# EAGLE design IonSensorRevC (EAGLE 9.6.2)
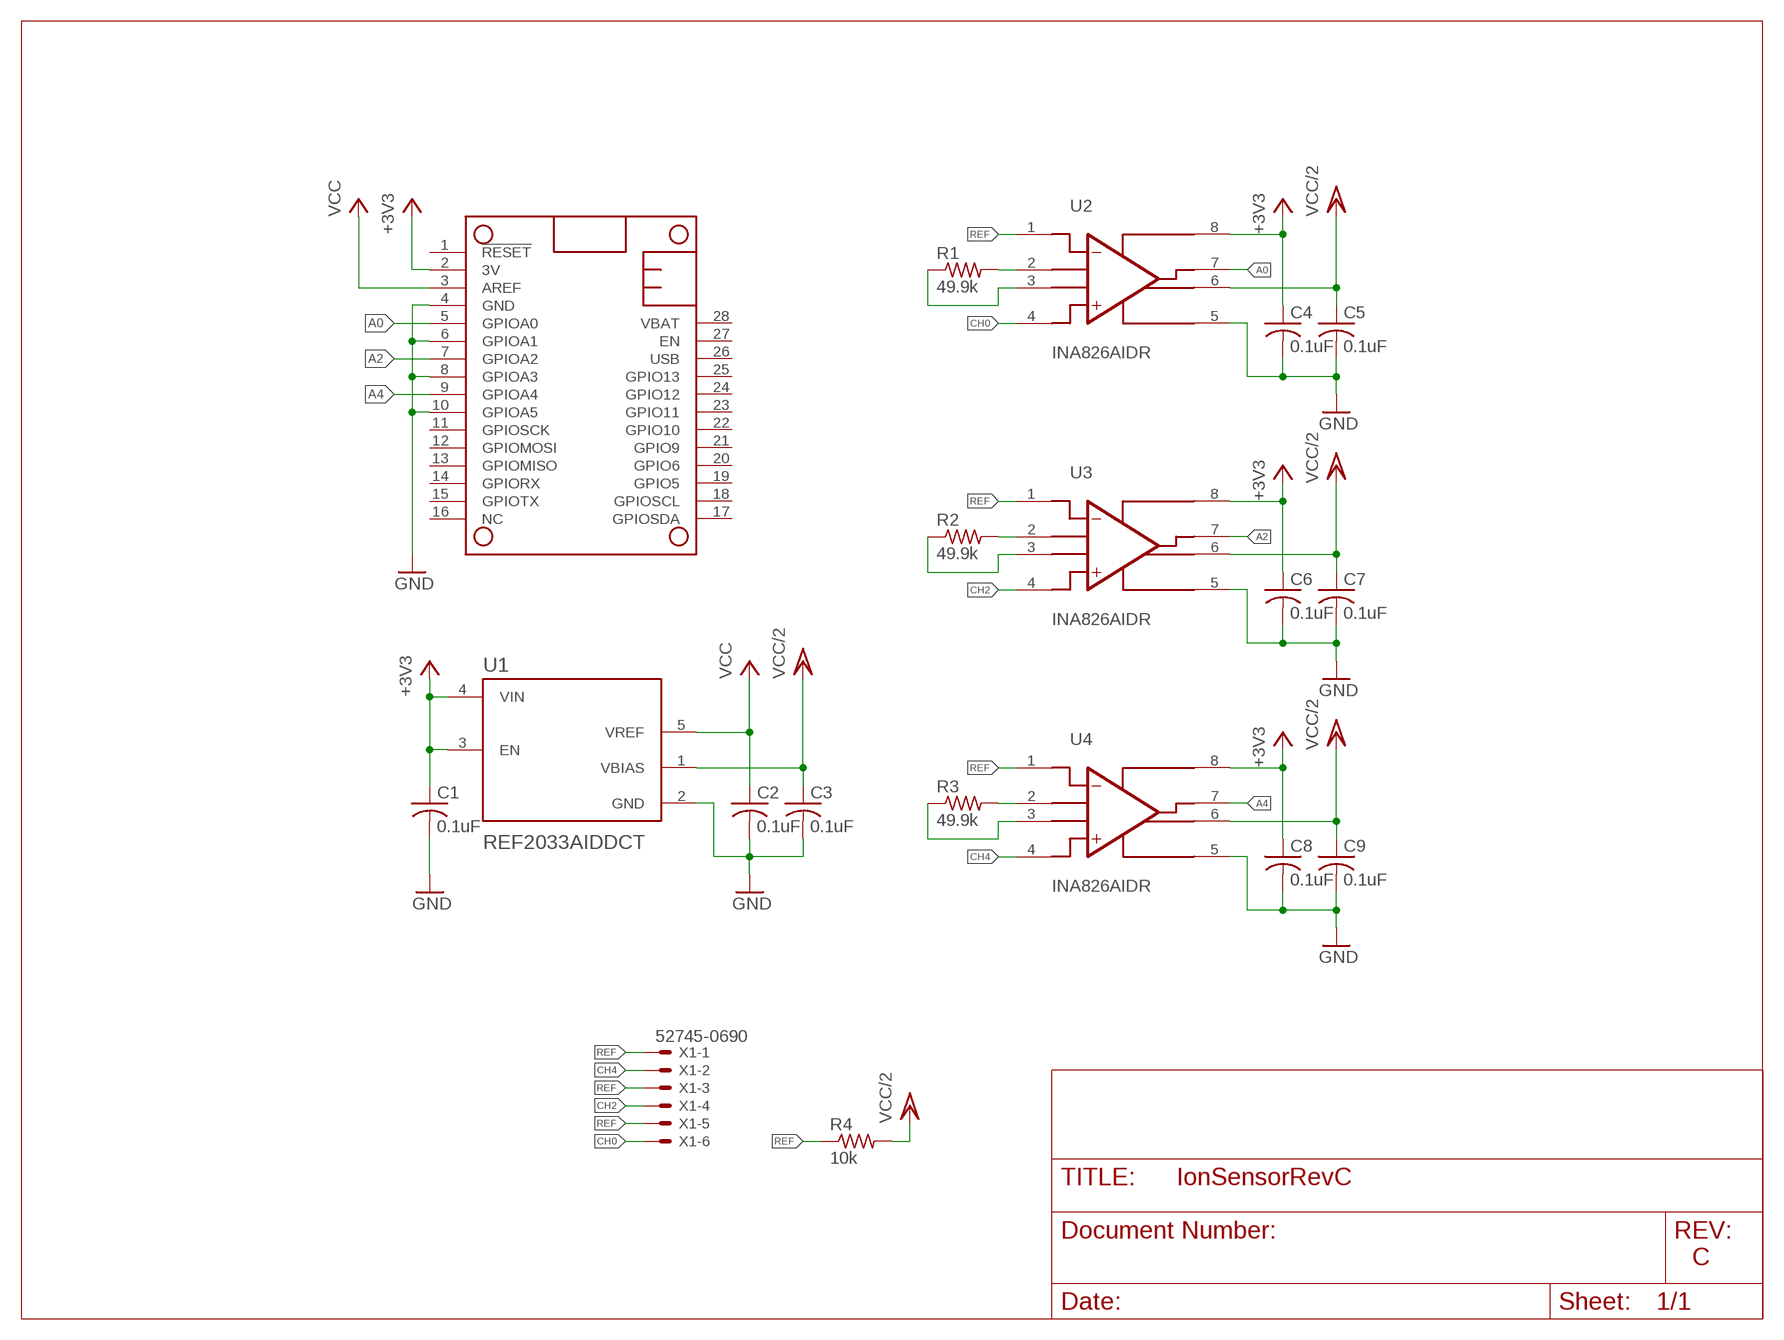
[diagram p0: schematic, sheet 1]

## Parts
C1  0.1uF  C-USC0402  [C0402]
C2  0.1uF  C-USC0402  [C0402]
C3  0.1uF  C-USC0402  [C0402]
C4  0.1uF  C-USC0402  [C0402]
C5  0.1uF  C-USC0402  [C0402]
C6  0.1uF  C-USC0402  [C0402]
C7  0.1uF  C-USC0402  [C0402]
C8  0.1uF  C-USC0402  [C0402]
C9  0.1uF  C-USC0402  [C0402]
MS1  FEATHERWING  [FEATHERWING]
R1  49.9k  R-US_R0402  [R0402]
R2  49.9k  R-US_R0402  [R0402]
R3  49.9k  R-US_R0402  [R0402]
R4  10k  R-US_R0402  [R0402]
U1  REF2033AIDDCT  [SOT95P280X110-5N]
U2  INA826AIDR  [SOIC127P599X175-8N]
U3  INA826AIDR  [SOIC127P599X175-8N]
U4  INA826AIDR  [SOIC127P599X175-8N]
X1  52745-0690  [52745-0690]

## Nets
+3V3: C1.1 C4.1 C6.1 C8.1 MS1.2(3V) U1.3(EN) U1.4(VIN) U2.8(+VS) U3.8(+VS) U4.8(+VS)
A0: MS1.5(GPIOA0) U2.7(VOUT)
A2: MS1.7(GPIOA2) U3.7(VOUT)
A4: MS1.9(GPIOA4) U4.7(VOUT)
CH0: U2.4(+IN) X1.6
CH2: U3.4(+IN) X1.4
CH4: U4.4(+IN) X1.2
GND: C1.2 C2.2 C3.2 C4.2 C5.2 C6.2 C7.2 C8.2 C9.2 MS1.4(GND) MS1.6(GPIOA1) MS1.8(GPIOA3) MS1.10(GPIOA5) U1.2(GND) U2.5(-VS) U3.5(-VS) U4.5(-VS)
N$1: R1.2 U2.2(RG_2)
N$2: R1.1 U2.3(RG_3)
N$3: R2.2 U3.2(RG_2)
N$4: R2.1 U3.3(RG_3)
N$5: R3.2 U4.2(RG_2)
N$6: R3.1 U4.3(RG_3)
REF: R4.1 U2.1(-IN) U3.1(-IN) U4.1(-IN) X1.1 X1.3 X1.5
VCC: C2.1 MS1.3(AREF) U1.5(VREF)
VCC/2: C3.1 C5.1 C7.1 C9.1 R4.2 U1.1(VBIAS) U2.6(REF) U3.6(REF) U4.6(REF)
Unconnected: MS1.1(!RESET) MS1.11(GPIOSCK) MS1.12(GPIOMOSI) MS1.13(GPIOMISO) MS1.14(GPIORX) MS1.15(GPIOTX) MS1.16(NC) MS1.17(GPIOSDA) MS1.18(GPIOSCL) MS1.19(GPIO5) MS1.20(GPIO6) MS1.21(GPIO9) MS1.22(GPIO10) MS1.23(GPIO11) MS1.24(GPIO12) MS1.25(GPIO13) MS1.26(USB) MS1.27(EN) MS1.28(VBAT)

## Notes on the sheet
- C

## Library data of the parts
C1-C9 = adafruit:C-US: CAPACITOR, American symbol
MS1 = adafruit:FEATHERWING
R1-R4 = adafruit:R-US_: RESISTOR, American symbol
U1 = REF2033AIDDCT:REF2033AIDDCT: 3.3-V Vref, low-drift, low-power, dual-output Vref & Vref/2 voltage reference 5-SOT-23-THIN -40 to 125 Check availability <https://pricing.snapeda.com/parts/REF2033AIDDCT/Texas%20Instruments/view-part?ref=eda>; AVAILABILITY: In Stock; DESCRIPTION: 3.3-V Vref, low-drift, low-power, dual-output Vref & Vref/2 voltage reference; MF: Texas Instruments; MP: REF2033AIDDCT; PACKAGE: SOT-23-THN-5 Texas Instruments; PRICE: None; PURCHASE-URL: https://pricing.snapeda.com/search/part/REF2033AIDDCT/?ref=eda
U2-U4 = INA826AIDR:INA826AIDR: Precision, 200-?A Supply Current, 36-V Supply Instrumentation Amplifier 8-SOIC -40 to 125 Check availability <https://pricing.snapeda.com/parts/INA826AIDR/Texas%20Instruments/view-part?ref=eda>; AVAILABILITY: In Stock; DESCRIPTION: Precision, 200-μA Supply Current, 36-V Supply Instrumentation Amplifier; MF: Texas Instruments; MP: INA826AIDR; PACKAGE: SOIC-8 Texas Instruments; PRICE: None; PURCHASE-URL: https://pricing.snapeda.com/search/part/INA826AIDR/?ref=eda
X1 = con-molex:52745-0690: FFC/FPC-to-Board 0.50mm (.020") SMT Top Contact Right Angle, ZIF, Style Receptacle 52745 / 52435 Source: http://www.molex.com/product/ffc/52745.html; MF: MOLEX; MPN: 52745-0690; OC_FARNELL: unknown; OC_NEWARK: 92M6374

## Board
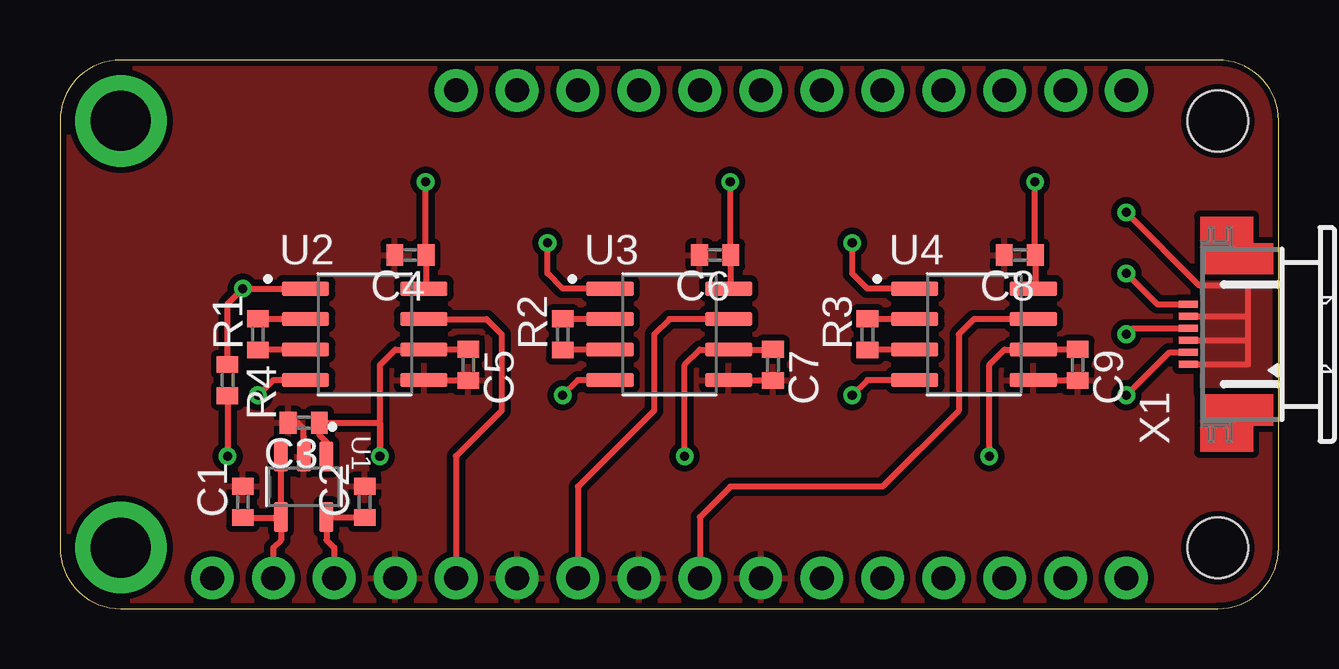
[diagram p1: board, top side]
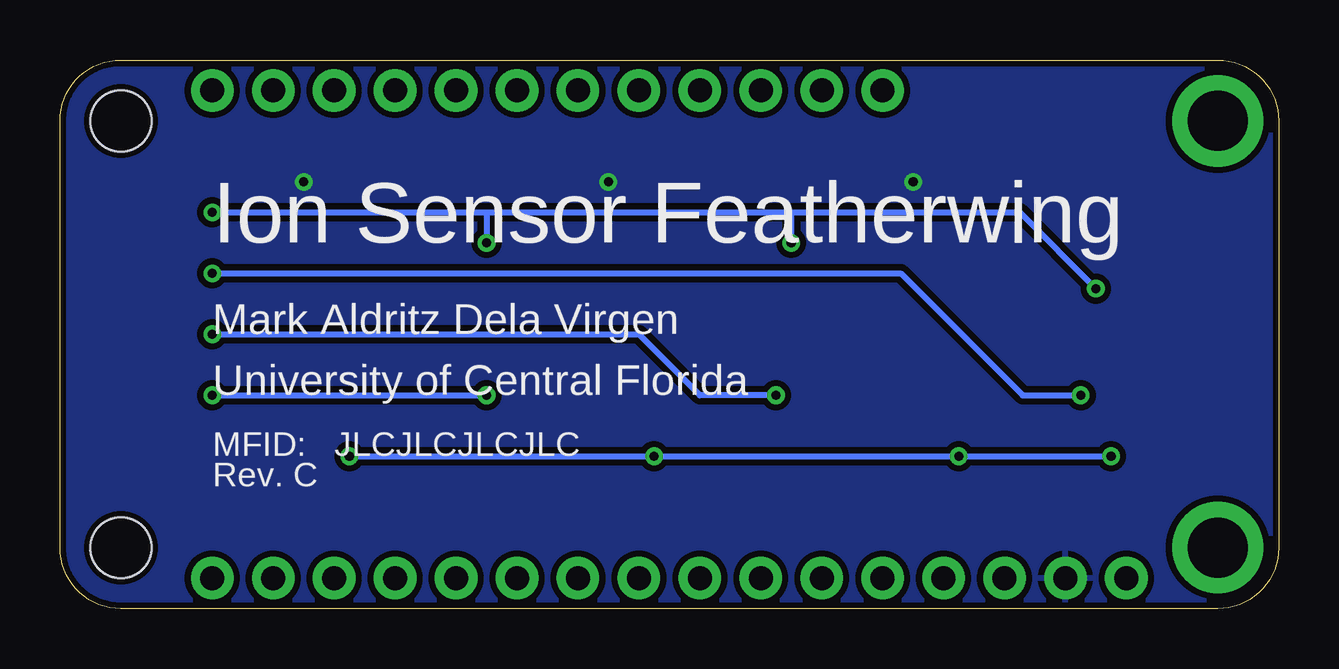
[diagram p2: board, bottom side, seen from below]

Size 50.8 x 22.86 mm. Coordinates in mm from the lower left corner, seen from the top.
Copper layers (1*16): Top 0.035mm / dielectric 1.5mm / Bottom 0.035mm
Design rules "SparkFun-2-Layer-General-JLCPCB": minimum track width 7mil, minimum drill 0.3mm, track to track 7mil, track to pad 7mil, pad to pad 7mil, via to via 7mil, smd to smd 7mil, copper to edge 7mil, drill to drill 7mil, minimum pad ring 7mil, minimum via ring 7mil, stop-mask expansion 3mil, vias tented up to drill 25mil, thermal gap 10mil

### Footprints (pad centres in the part's own frame; a part is rotated, then mirrored left to right if it is on the bottom)
C0402 = smd 0.7 x 0.9: 1 -0.65,0; 2 0.65,0
FEATHERWING = drill 1 pad 1.778: 1 6.35,1.27; 2 8.89,1.27; 3 11.43,1.27; 4 13.97,1.27; 5 16.51,1.27; 6 19.05,1.27; 7 21.59,1.27; 8 24.13,1.27; 9 26.67,1.27; 10 29.21,1.27; 11 31.75,1.27; 12 34.29,1.27; 13 36.83,1.27; 14 39.37,1.27; 15 41.91,1.27; 16 44.45,1.27; 17 44.45,21.59; 18 41.91,21.59; 19 39.37,21.59; 20 36.83,21.59; 21 34.29,21.59; 22 31.75,21.59; 23 29.21,21.59; 24 26.67,21.59; 25 24.13,21.59; 26 21.59,21.59; 27 19.05,21.59; 28 16.51,21.59 | drill 2.5 pad 3.81: P$1 2.54,20.32; P$2 2.54,2.54 | hole 2.54: 48.26,20.32; 48.26,2.54
R0402 = smd 0.7 x 0.9: 1 -0.65,0; 2 0.65,0
SOT95P280X110-5N = smd 1.25 x 0.59: 1 -1.255,0.95; 2 -1.255,0; 3 -1.255,-0.95; 4 1.255,-0.95; 5 1.255,0.95
SOIC127P599X175-8N = smd 1.97 x 0.6: 1 -2.47,1.905; 2 -2.47,0.635; 3 -2.47,-0.635; 4 -2.47,-1.905; 5 2.47,-1.905; 6 2.47,-0.635; 7 2.47,0.635; 8 2.47,1.905
52745-0690 = smd 0.3 x 0.8: 1 -1.25,2.5; 2 -0.75,2.5; 3 -0.25,2.5; 4 0.25,2.5; 5 0.75,2.5; 6 1.25,2.5

### Placement (x,y rotation side)
C1  7.62,4.45 90 top
C2  12.7,4.45 90 top
C3  10.16,7.75 180 top
C4  14.61,14.73 180 top
C5  17.02,10.16 270 top
C6  27.3,14.73 180 top
C7  29.72,10.16 270 top
C8  40.01,14.73 180 top
C9  42.42,10.16 270 top
MS1  0,0 0 top
R1  8.26,11.43 90 top
R2  20.95,11.43 90 top
R3  33.66,11.43 90 top
R4  6.99,9.53 270 top
U1  10.16,5.08 270 top
U2  12.7,11.43 0 top
U3  25.4,11.43 0 top
U4  38.1,11.43 0 top
X1  49.53,11.43 90 top

### Tracks (layer width: path | path; a pad name or v marks a point on that pad's centre or on a via)
+3V3  (via drill 0.38)
  Top 0.254: MS1.2 8.89,2.54 9.21,2.86 U1.4 | C1.1 9.18,3.79 U1.4 | U2.8 15.26,13.42 C4.1 15.24,14.75 v15.24,17.78 | U3.8 27.95,13.42 C6.1 27.94,14.75 v27.94,17.78 | U4.8 40.66,13.42 C8.1 40.64,14.75 v40.64,17.78 | U1.4 U1.3
  pour Bottom (isolate 0.254): 50.8,0 50.8,24.13 -1.27,24.13 -1.27,0
A0
  Top 0.254: U2.7 17.78,12.06 18.41,11.43 18.41,8.26 16.51,6.35 MS1.5
A2
  Top 0.254: U3.7 25.4,12.06 24.77,11.43 24.77,8.26 21.59,5.08 MS1.7
A4
  Top 0.254: U4.7 38.1,12.06 37.47,11.43 37.47,8.26 34.29,5.08 27.94,5.08 26.67,3.81 MS1.9
CH0  (via drill 0.38)
  Top 0.254: U2.4 8.89,9.53 v8.26,8.89 | v44.45,13.97 45.74,12.68 X1.6
  Bottom 0.254: v44.45,13.97 15.75,13.97 10.67,8.89 v8.26,8.89
CH2  (via drill 0.38)
  Top 0.254: U3.4 21.59,9.53 v20.95,8.89 | v44.45,11.43 44.7,11.68 X1.4
  Bottom 0.254: v44.45,11.43 26.67,11.43 24.13,8.89 v20.95,8.89
CH4  (via drill 0.38)
  Top 0.254: U4.4 33.66,9.53 v33.02,8.89 | v44.45,8.89 46.24,10.68 X1.2
  Bottom 0.254: v44.45,8.89 v33.02,8.89
GND
  Top 0.254: U2.5 17,9.53 C5.2 | U3.5 29.7,9.53 C7.2 | U4.5 42.4,9.53 C9.2 | C3.2 9.91,7.75 10.15,7.5 10.15,7.17 10.16,7.17 U1.2
  pour Top (isolate 0.254, rank 2): 0,22.86 0,-1.27 52.07,-1.27 52.07,22.86
N$1
  Top 0.254: U2.2 8.27,12.06 R1.2
N$2
  Top 0.254: U2.3 8.27,10.79 R1.1
N$3
  Top 0.254: U3.2 20.97,12.06 R2.2
N$4
  Top 0.254: U3.3 20.97,10.79 R2.1
N$5
  Top 0.254: U4.2 33.67,12.06 R3.2
N$6
  Top 0.254: U4.3 33.67,10.79 R3.1
REF  (via drill 0.38)
  Top 0.254: v33.02,15.24 33.02,13.97 33.66,13.34 U4.1 | U3.1 20.95,13.34 20.32,13.97 v20.32,15.24 | U2.1 v7.62,13.34 6.99,12.7 R4.1 | v44.45,16.51 47.5,13.46 49.53,13.46 49.53,12.18 | X1.1 49.53,10.18 49.53,11.18 | X1.3 49.53,11.18 | X1.5 49.53,12.18 | 49.53,11.18 49.53,12.18
  Bottom 0.254: v44.45,16.51 33.02,16.51 | 33.02,16.51 v33.02,15.24 | 33.02,16.51 20.32,16.51 | v20.32,15.24 20.32,16.51 | 20.32,16.51 10.79,16.51 v7.62,13.34
  pour Top (isolate 0.254): 47.62,16.51 51.44,16.51 51.44,6.35 47.62,6.35
VCC
  Top 0.254: MS1.3 11.43,2.54 11.11,2.86 U1.5 11.14,3.79 C2.1
VCC/2  (via drill 0.38)
  Top 0.254: C5.1 15.19,10.81 U2.6 13.97,10.79 13.34,10.16 v13.34,6.35 13.34,7.75 C3.1 10.81,7.24 11.11,6.94 U1.1 | C7.1 29.7,10.79 U3.6 26.67,10.79 26.04,10.16 v26.04,6.35 | C9.1 40.59,10.81 U4.6 39.37,10.79 38.73,10.16 v38.73,6.35 | R4.2 v6.99,6.35
  Bottom 0.254: v6.99,6.35 v13.34,6.35 v26.04,6.35 v38.73,6.35

### Text on the board
bPlace: Ion Sensor Featherwing | Mark Aldritz Dela Virgen | University of Central Florida | JLCJLCJLCJLC | MFID: | Rev. C